# EAGLE design v3_Shield (EAGLE 6.5.0)
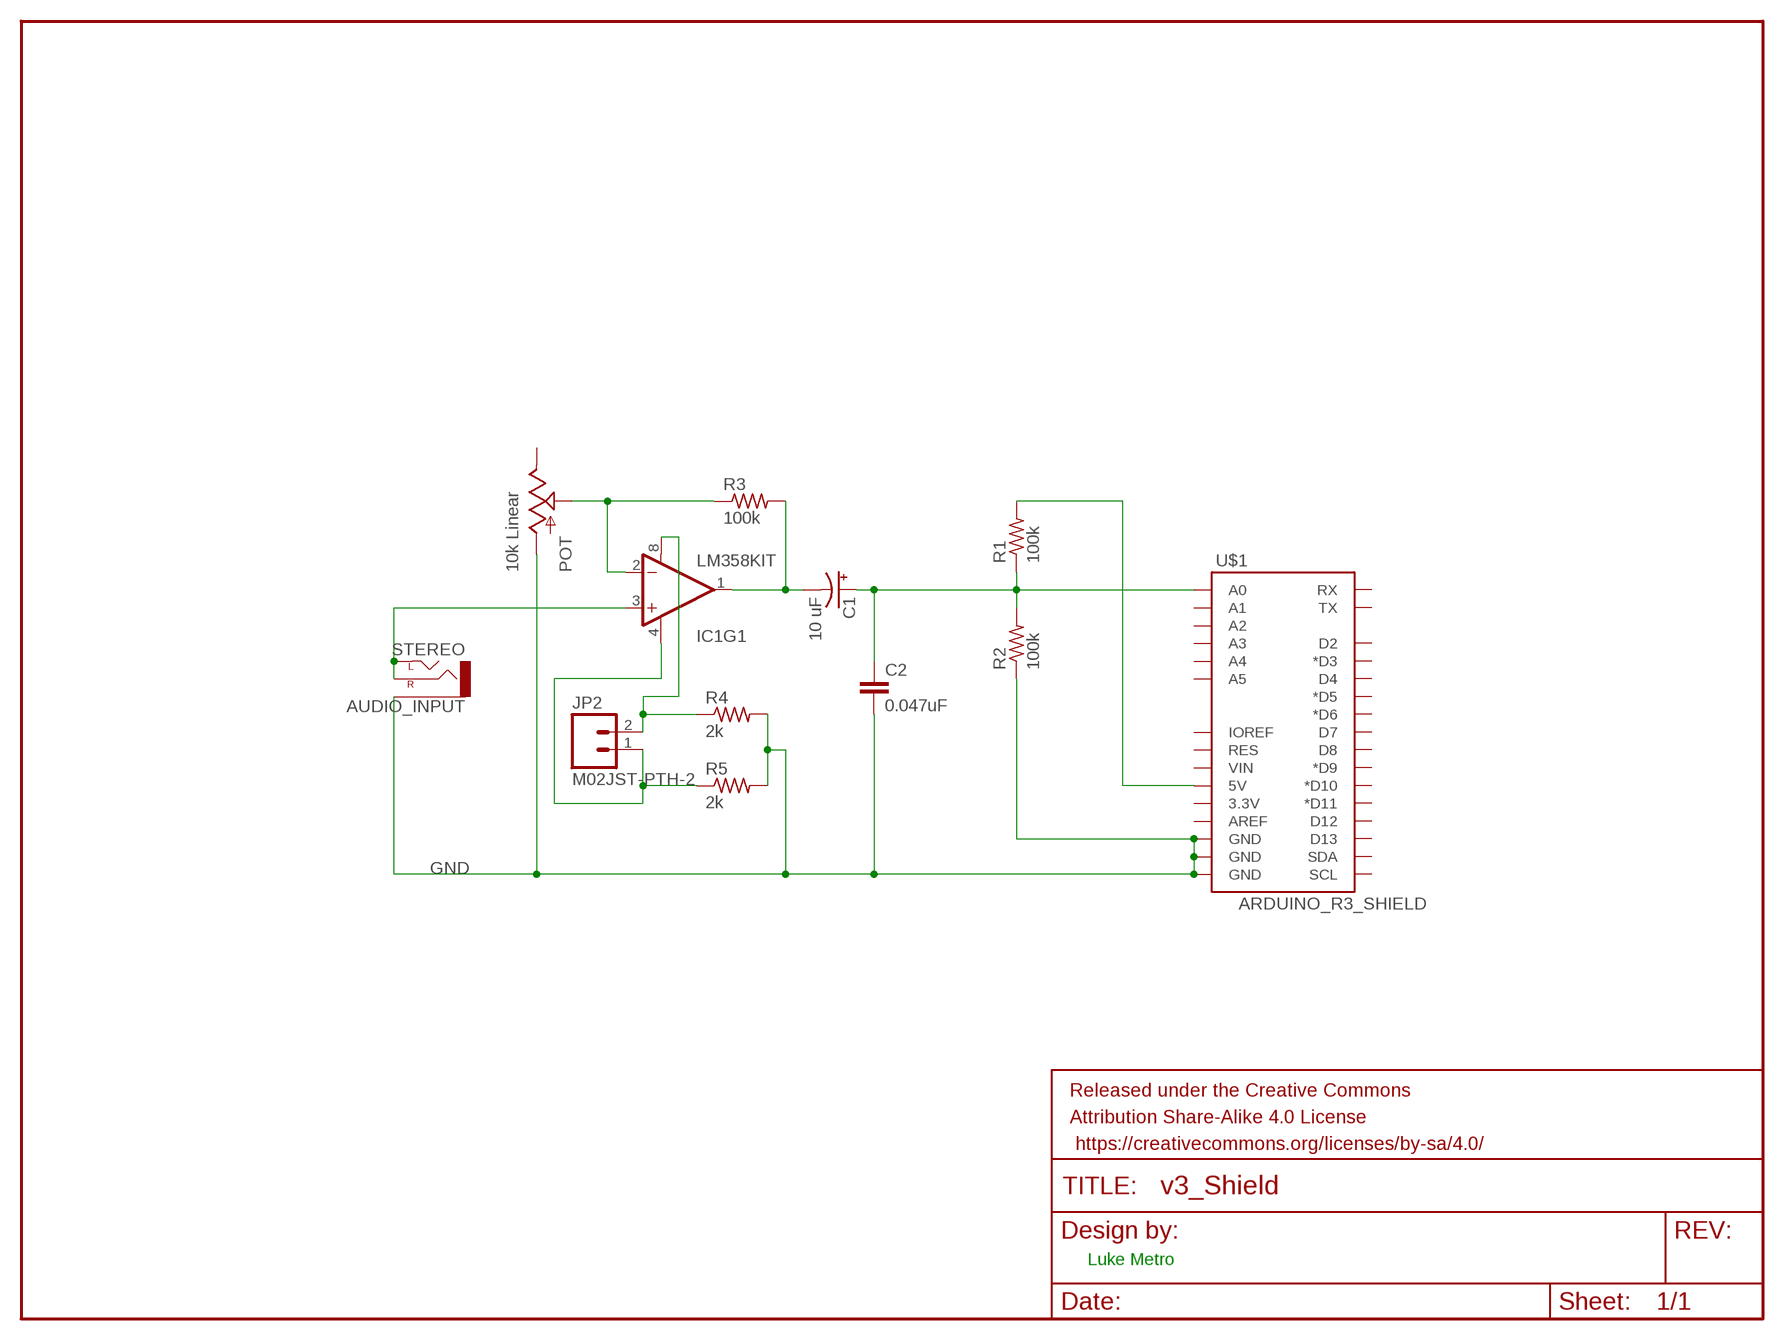
[diagram p0: schematic, sheet 1]

## Parts
AUDIO_INPUT  STEREO  AUDIO-JACKPTH  [AUDIO-JACK]
C1  10 uF  CAP_POL6032  [EIA6032]
C2  0.047uF  CAP0402-CAP  [0402-CAP]
FRAME1  FRAME-LETTER  [CREATIVE_COMMONS]
IC1  LM358KIT  [DIP08-KIT]
JP2  M02JST-PTH-2  [JST-2-PTH]
POT  10k Linear  POT  [ALPS_POT]
R1  100k  FLIPFLOP-RES  [0805-THM]
R2  100k  FLIPFLOP-RES  [0805-THM]
R3  100k  FLIPFLOP-RES  [0805-THM]
R4  2k  FLIPFLOP-RES  [0805-THM]
R5  2k  FLIPFLOP-RES  [0805-THM]
U$1  ARDUINO_R3_SHIELD  [UNO_R3_SHIELD]

## Nets
2.5V_OFFSET_HOT: R1.2 U$1.5V
GND: AUDIO_INPUT.SLEEVE C2.2 POT.P$3(A) R2.1 R4.2 R5.2 U$1.GND@0(GND) U$1.GND@1(GND) U$1.GND@2(GND)
OPAMP_IN: AUDIO_INPUT.RING(RIGHT) AUDIO_INPUT.TIP(LEFT) IC1.3(+IN)
OPAMP_INVERTING_INPUT: IC1.2(-IN) POT.P$2(S) R3.1
OPAMP_OUT: C1.P$2(-) IC1.1(OUT) R3.2
OPAMP_PWR_COLD: IC1.4(V-) JP2.1 R5.1
OPAMP_PWR_HOT: IC1.8(V+) JP2.2 R4.1
OUTPUT_SIGNAL: C1.P$1(+) C2.1 R1.1 R2.2 U$1.A0
Unconnected: IC1.5(+IN) IC1.6(-IN) IC1.7(OUT) POT.P$1(E) U$1.3.3V U$1.A1 U$1.A2 U$1.A3 U$1.A4 U$1.A5 U$1.AREF U$1.D2 U$1.D3(*D3) U$1.D4 U$1.D5(*D5) U$1.D6(*D6) U$1.D7 U$1.D8 U$1.D9(*D9) U$1.D10(*D10) U$1.D11(*D11) U$1.D12 U$1.D13 U$1.IOREF U$1.RES U$1.RX U$1.SCL U$1.SDA U$1.TX U$1.VIN

## Notes on the sheet
- Luke Metro

## Library data of the parts
AUDIO_INPUT = SparkFun-Connectors:AUDIO-JACK: 3.5mm Audio Jack Simple 3.5mm common PCB mount audio jack. SKU: PRT-08032
C1 = SparkFun-Capacitors:CAP_POL: Capacitor Polarized These are standard SMD and PTH capacitors. Normally 10uF, 47uF, and 100uF in electrolytic and tantalum varieties. Always verify the external diameter of the through hole cap, it varies with capacity, voltage, and manufacturer. The EIA devices should be standard.
C2 = SparkFun-Passives:CAP: Capacitor Standard 0603 ceramic capacitor, and 0.1" leaded capacitor.
FRAME1 = SparkFun-Aesthetics:FRAME-LETTER: Schematic Frame Standard 8.5x11 US Letter frame
IC1 = SparkFun-AnalogIC:LM358: Jellybean op-amp; PROD_ID: IC-09172
JP2 = SparkFun-Connectors:M02: Standard 2-pin 0.1" header. Use with - straight break away headers ( PRT-00116) - right angle break away headers (PRT-00553) - swiss pins (PRT-00743) - machine pins (PRT-00117) - female headers (PRT-00115) Molex polarized connector foot print use with: PRT-08233 with associated crimp pins and housings. 2.54_SCREWTERM for use with PRT-10571. 3.5mm Screw Terminal footprints for PRT-08084 5mm Screw Terminal footprints for use with PRT-08433; SKU: PRT-09914
POT = SparkFun-Electromechanical:POT
R1-R5 = adafruit:FLIPFLOP-RES: Flip Flop resistor An 0805 resistor inside a standard 1/4W 5% resistor. Makes for easy mods
U$1 = SparkFun-Boards:ARDUINO_R3_SHIELD: Shield form compatible with the Arduino Uno R3.

## Board
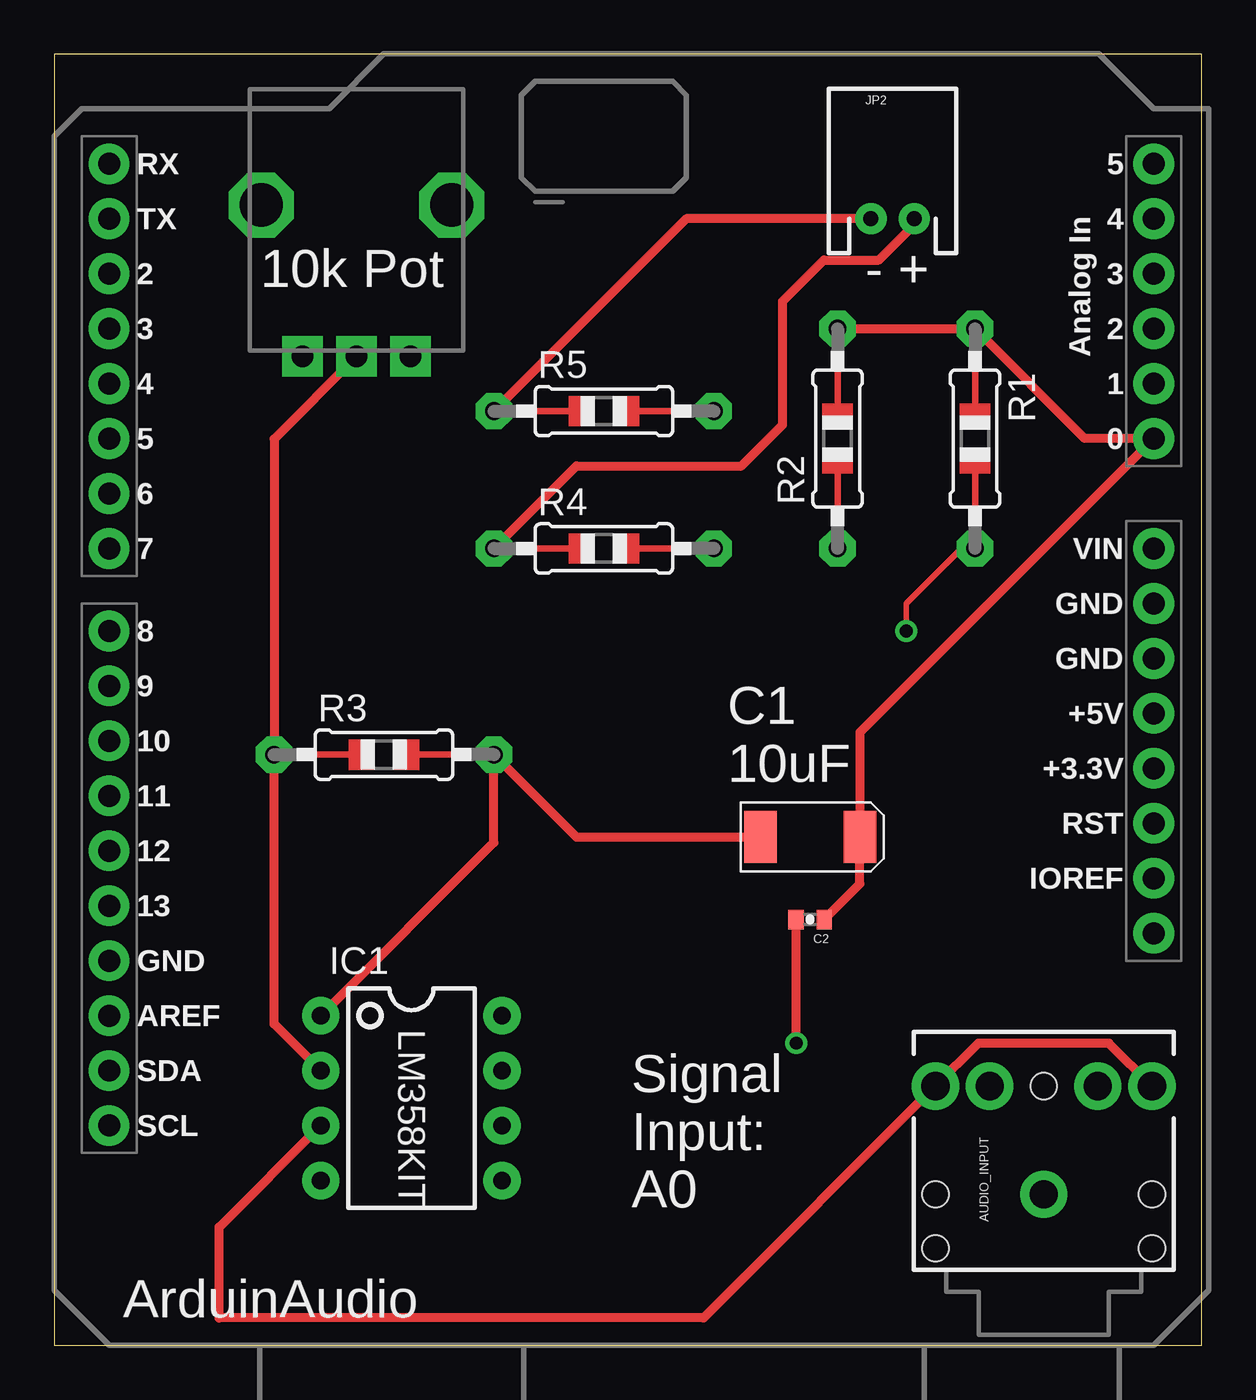
[diagram p1: board, top side]
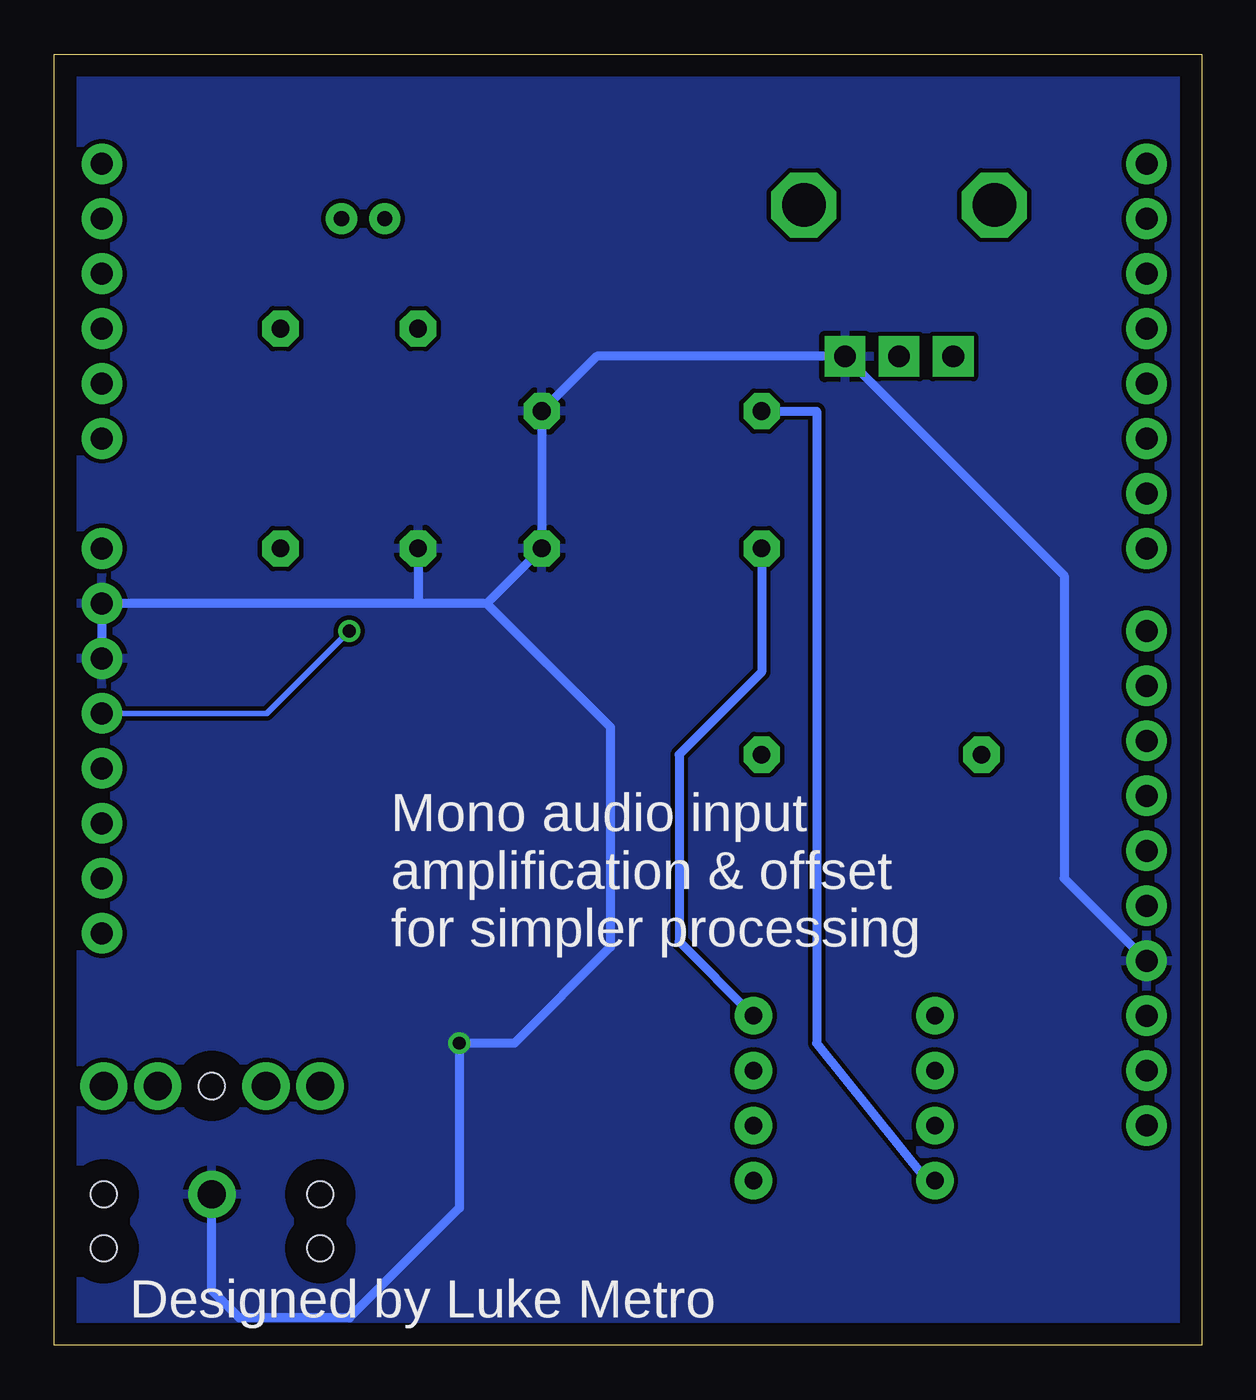
[diagram p2: board, bottom side, seen from below]

Size 53.01 x 59.68 mm. Coordinates in mm from the lower left corner, seen from the top.
Outline: 0,0 53.01,0 53.01,59.68 0,59.68 0,0
Copper layers (1*16): Top 0.035mm / dielectric 1.5mm / Bottom 0.035mm
Design rules "default": minimum track width 10mil, minimum drill 24mil, track to track 8mil, track to pad 8mil, pad to pad 8mil, via to via 8mil, smd to smd 8mil, copper to edge 40mil, drill to drill 8mil, minimum pad ring 10mil, minimum via ring 8mil, stop-mask expansion 4mil, vias tented up to drill 0mil, thermal gap 10mil

### Footprints (pad centres in the part's own frame; a part is rotated, then mirrored left to right if it is on the bottom)
AUDIO-JACK = drill 1.3 pad 2.184: RING 5,5; RSH 5,2.5; SLEEVE 0,0; TIP 5,-5; TSH 5,-2.5 | hole 1.2: 0,5; -2.5,5; -2.5,-5; 0,-5; 5,0
EIA6032 = smd 1.5 x 2.4: P$1 -2.3,0; P$2 2.3,0
0402-CAP = smd 0.7 x 0.9: 1 -0.65,0; 2 0.65,0
DIP08-KIT = drill 0.813 pad 1.727: 1 -3.81,-4.191; 2 -1.27,-4.191; 3 1.27,-4.191; 4 3.81,-4.191; 5 3.81,4.191; 6 1.27,4.191; 7 -1.27,4.191; 8 -3.81,4.191
JST-2-PTH = drill 0.7 pad 1.448: 1 -1,0; 2 1,0
ALPS_POT = drill 1 pad 1.88 square: P$1 7,-2.5; P$2 7,0; P$3 7,2.5 | drill 2 octagon: P$4 0,-4.4; P$5 0,4.4
0805-THM = drill 0.813 pad 1.676 octagon: 1 -5.08,0; 2 5.08,0
UNO_R3_SHIELD = drill 1.016 pad 1.88: 3.3V 50.8,26.67; 5V 50.8,29.21; A0 50.8,41.91; A1 50.8,44.45; A2 50.8,46.99; A3 50.8,49.53; A4 50.8,52.07; A5 50.8,54.61; AREF 2.54,15.24; D2 2.54,49.53; D3 2.54,46.99; D4 2.54,44.45; D5 2.54,41.91; D6 2.54,39.37; D7 2.54,36.83; D8 2.54,33.02; D9 2.54,30.48; D10 2.54,27.94; D11 2.54,25.4; D12 2.54,22.86; D13 2.54,20.32; GND@0 50.8,31.75; GND@1 50.8,34.29; GND@2 2.54,17.78; IOREF 50.8,21.59; NC 50.8,19.05; RES 50.8,24.13; RX 2.54,54.61; SCL 2.54,10.16; SDA 2.54,12.7; TX 2.54,52.07; VIN 50.8,36.83

### Placement (x,y rotation side)
AUDIO_INPUT  45.72,6.99 90 top
C1  34.92,23.5 180 top
C2  34.92,19.68 180 top
FRAME1  5.71,-24.13 0 top  (outside the outline)
IC1  16.51,11.43 270 top
JP2  38.73,52.07 0 top
POT  13.97,52.7 270 top
R1  42.55,41.91 270 top
R2  36.2,41.91 90 top
R3  15.24,27.3 0 top
R4  25.4,36.83 0 top
R5  25.4,43.18 0 top
U$1  0,0 0 top

### Tracks (layer width: path | path; a pad name or v marks a point on that pad's centre or on a via)
2.5V_OFFSET_HOT  (via drill 0.61)
  Top 0.254: v39.37,33.02 39.37,34.29 41.91,36.83 R1.2
  Bottom 0.254: v39.37,33.02 43.18,29.21 U$1.5V
GND  (via drill 0.6)
  Top 0.406: C2.2 34.27,13.98 v34.29,13.97
  Bottom 0.406: U$1.GND@2 6.35,21.59 6.35,35.59 POT.P$3 16.5,45.7 16.51,45.72 27.94,45.72 R5.2 R4.2 33.02,34.29 | AUDIO_INPUT.SLEEVE 45.72,2.54 44.45,1.27 39.37,1.27 34.29,6.35 v34.29,13.97 31.75,13.97 27.3,18.41 27.3,28.57 33.02,34.29 | 33.02,34.29 36.2,34.29 | 36.2,34.29 U$1.GND@1 U$1.GND@0 | R2.1 36.2,34.29
  pour Bottom: 0.64,59.05 52.07,59.05 52.07,38.1 52.07,0.64 0.64,0.64 0.64,3.81
OPAMP_IN
  Top 0.406: AUDIO_INPUT.TIP 48.73,13.97 42.7,13.97 AUDIO_INPUT.RING 30,1.27 7.62,1.27 7.62,5.46 IC1.3
OPAMP_INVERTING_INPUT
  Top 0.406: POT.P$2 10.16,41.9 R3.1 10.16,14.86 IC1.2
OPAMP_OUT
  Top 0.406: C1.P$2 24.13,23.5 R3.2 20.32,23.24 IC1.1
OPAMP_PWR_COLD
  Top 0.406: JP2.1 29.21,52.07 R5.1
  Bottom 0.254: 12.7,7.62 IC1.4
  Bottom 0.406: 12.7,7.62 17.78,13.97 17.78,43.18 R5.1
OPAMP_PWR_HOT
  Top 0.406: R4.1 24.13,40.64 31.75,40.64 33.66,42.55 33.66,48.26 35.56,50.16 38.1,50.16 39.73,51.8 JP2.2
  Bottom 0.406: R4.1 20.32,31.11 24.13,27.3 24.13,18.67 IC1.8
OUTPUT_SIGNAL
  Top 0.406: C2.1 37.23,21.34 C1.P$1 37.23,28.34 U$1.A0 47.62,41.91 R1.1 R2.2

### Text on the board
tNames: 10k Pot | - + | C1 / 10uF | Signal / Input: / A0 | ArduinAudio
bNames: Mono audio input / amplification & offset / for simpler processing | Designed by Luke Metro